# Altium schematic sheet 01 TITLE PAGE.SchDoc
size 513 x 386 mm
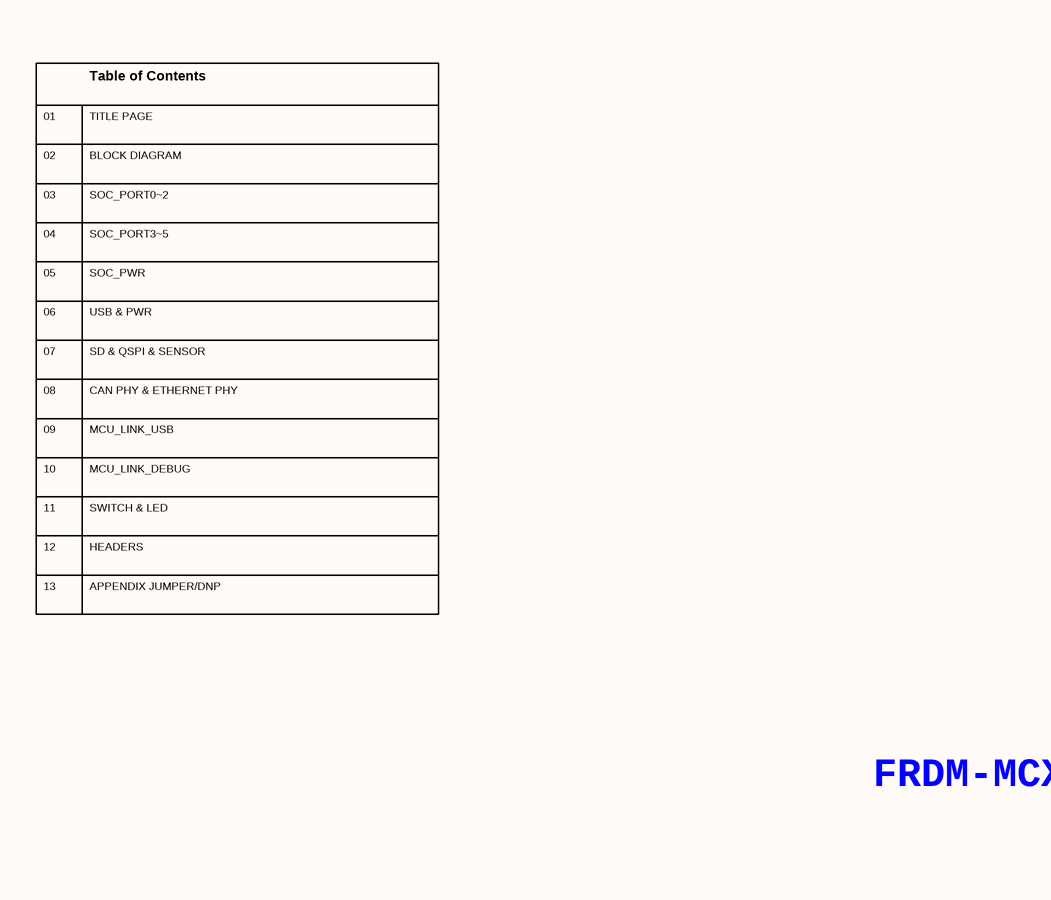
[diagram p0: 01 TITLE PAGE.SchDoc, left]
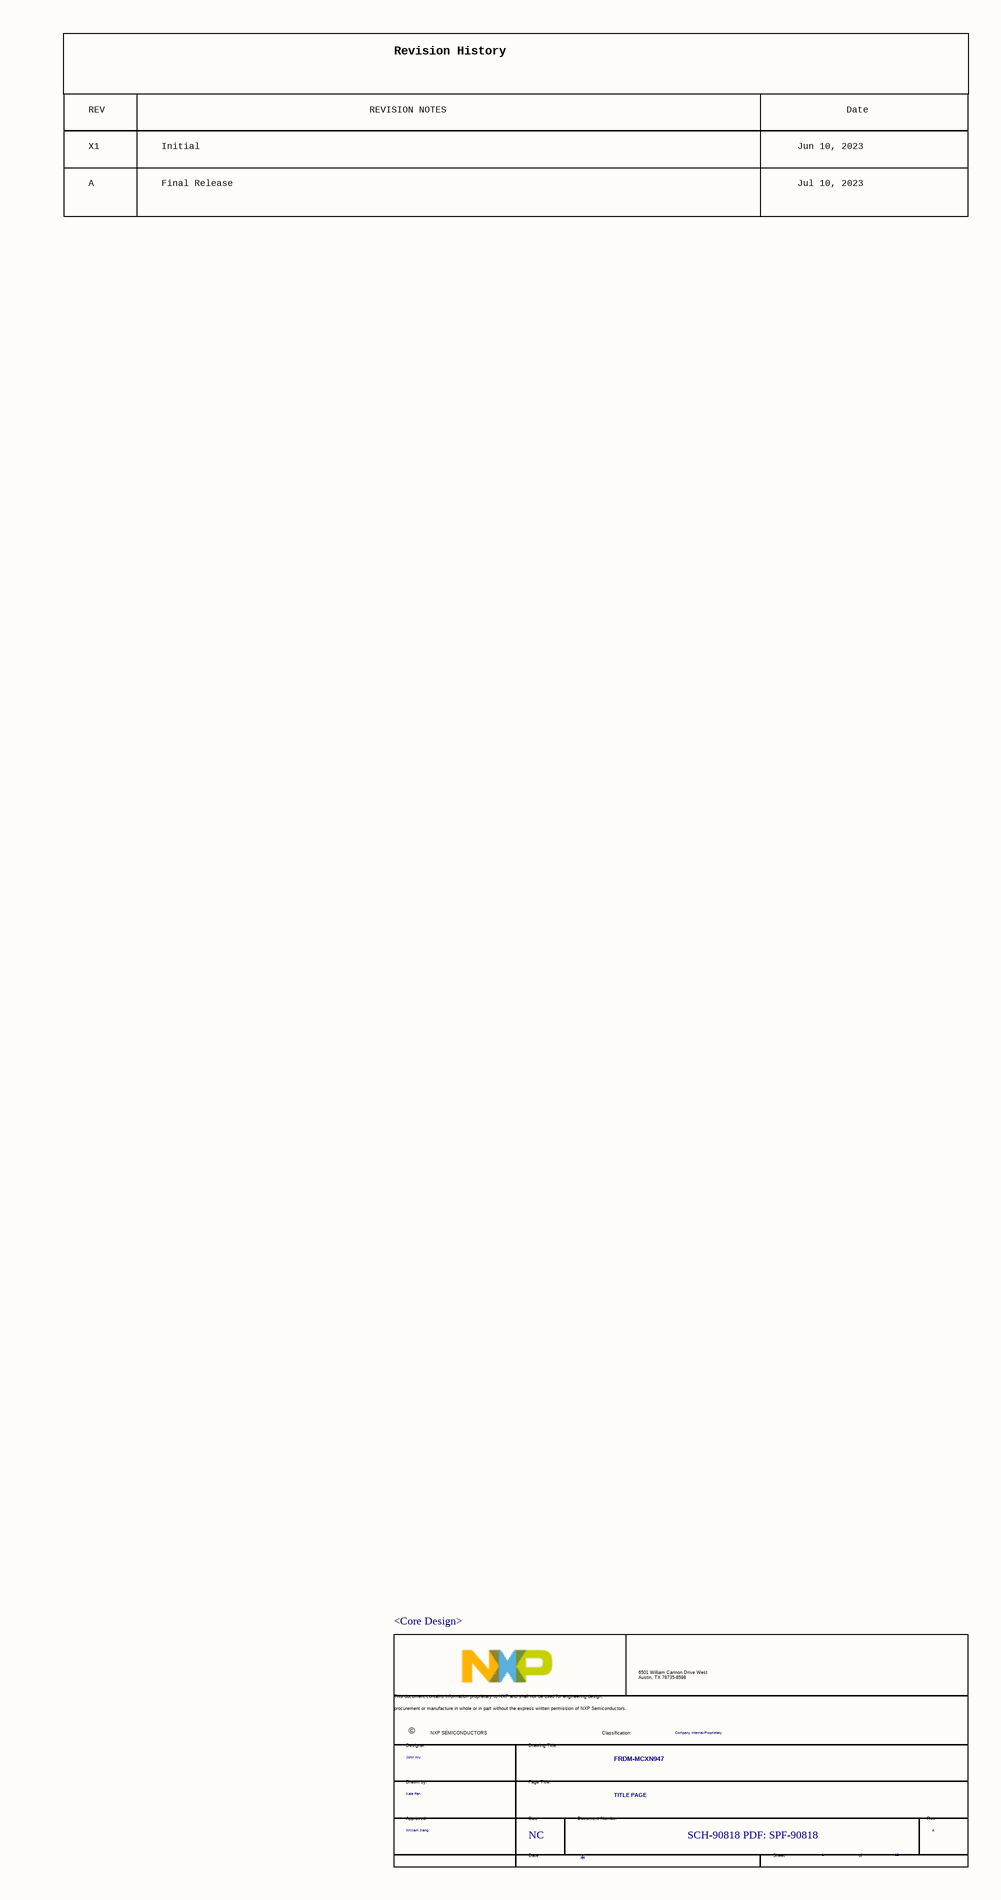
[diagram p1: 01 TITLE PAGE.SchDoc, right]

## Parts
*  Classification: Company Internal/Proprietary  DrawnBy: Kate Fan  Approver: William Jiang  Designer: John Wu  PageTitle: TITLE PAGE  Page Count: 13  Page Number: 1  Page Size: NC  Title: FRDM-MCXN947  RevCode: A  Doc: SCH-90818 PDF: SPF-90818  Variant Name: <Core Design>  (hidden comment: TitleBlock_NXP_Generic)  (graphical)

## Notes on the sheet
- Revision History
- 01
- Table of Contents
- TITLE PAGE
- REV
- REVISION NOTES
- Date
- 02
- 03
- BLOCK DIAGRAM
- SOC_PORT0~2
- X1
- A
- Initial
- Final Release
- Jun 10, 2023
- Jul 10, 2023
- 04
- 05
- SOC_PORT3~5
- SOC_PWR
- 06
- USB & PWR
- 07
- 08
- SD & QSPI & SENSOR
- CAN PHY & ETHERNET PHY
- 09
- 10
- MCU_LINK_USB
- MCU_LINK_DEBUG
- 11
- 12
- SWITCH & LED
- HEADERS
- 13
- APPENDIX JUMPER/DNP
- FRDM-MCXN947
- (in symbol TitleBlock_NXP_Generic) 6501 William Cannon Drive West / Austin, TX 78735-8598; This document contains information proprietary to NXP and shall not be used for engineering design,; procurement or manufacture in whole or in part without the express written permission of NXP Semiconductors.; ©; NXP SEMICONDUCTORS; Classification:; Designer:; Drawing Title:; Drawn by:; Page Title:; Approved:; Size; Document Number; Rev; Date:; Sheet; of

## Library data of the parts
* = TitleBlock_NXP_Generic: OrgName: NXP Semiconductors; OrgAddr1: 6501 William Cannon Drive West; OrgAddr2: Austin, TX 78735-8598; Page Create Date: March  8, 1995; Page Modify Date: *